# EAGLE design Thermostat (EAGLE 7.6.0)
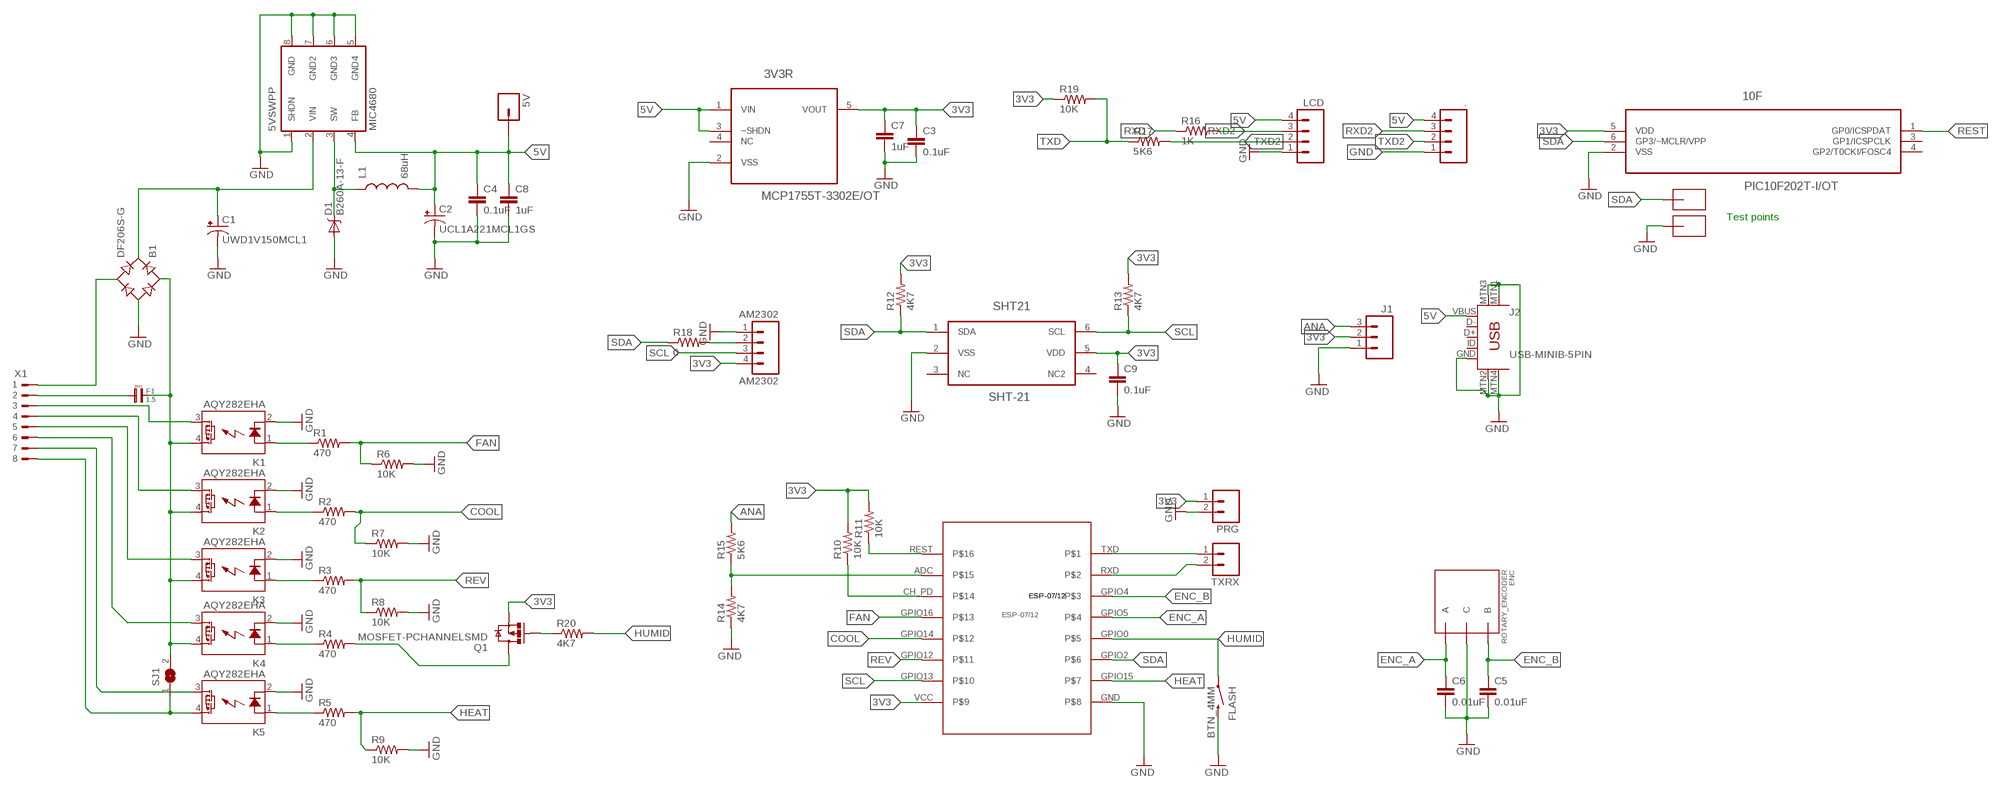
[diagram p0: schematic, sheet 1]

## Parts
3V3R  MCP1755T-3302E/OT  MCP1801T-3302I/OT  [SOT95P270X145-5N]
5V  M01PTH  [1X01]
5VSWPP  MIC4680  [SO08]
10F  PIC10F202T-I/OT  [SOT95P270X145-6N]
.  M04PTH  [1X04]
AM2302  AM2302  M04PTH  [1X04]
B1  DF206S-G  DF01S  [DFS]
C1  UWD1V150MCL1  CAP_POLC  [PANASONIC_C]
C2  UCL1A221MCL1GS  CAP_POLD  [PANASONIC_D]
C3  0.1uF  CAP0805  [0805]
C4  0.1uF  CAP0805  [0805]
C5  0.01uF  CAP0805  [0805]
C6  0.01uF  CAP0805  [0805]
C7  1uF  CAP0805  [0805]
C8  1uF  CAP0805  [0805]
C9  0.1uF  CAP0805  [0805]
D1  B260A-13-F  DIODE-SCHOTTKY_  [SMA-DIODE]
ENC  ROTARY_ENCODER  [ROTORY_ENC]
F1  1.5  0,1ÂµF  [L4,8]
FLASH  BTN_4MM  [BTN_4MM]
J1  M03PTH  [1X03]
J2  USB-MINIB-5PIN  [USB-MINIB]
K1  AQY282EHA  AQY22SOP  [SOP04]
K2  AQY282EHA  AQY22SOP  [SOP04]
K3  AQY282EHA  AQY22SOP  [SOP04]
K4  AQY282EHA  AQY22SOP  [SOP04]
K5  AQY282EHA  AQY22SOP  [SOP04]
L1  68uH  INDUCTORDR1030  [DR1030]
LCD  M04PTH  [1X04]
PRG  M02PTH  [1X02]
Q1  MOSFET-PCHANNELSMD  [SOT23-3]
R1  470  RESISTOR0805-RES  [0805]
R2  470  RESISTOR0805-RES  [0805]
R3  470  RESISTOR0805-RES  [0805]
R4  470  RESISTOR0805-RES  [0805]
R5  470  RESISTOR0805-RES  [0805]
R6  10K  RESISTOR0805-RES  [0805]
R7  10K  RESISTOR0805-RES  [0805]
R8  10K  RESISTOR0805-RES  [0805]
R9  10K  RESISTOR0805-RES  [0805]
R10  10K  RESISTOR0805-RES  [0805]
R11  10K  RESISTOR0805-RES  [0805]
R12  4K7  RESISTOR0805-RES  [0805]
R13  4K7  RESISTOR0805-RES  [0805]
R14  4K7  RESISTOR0805-RES  [0805]
R15  5K6  RESISTOR0805-RES  [0805]
R16  1K  RESISTOR0805-RES  [0805]
R17  5K6  RESISTOR0805-RES  [0805]
R18  0  RESISTOR0805-RES  [0805]
R19  10K  RESISTOR0805-RES  [0805]
R20  4K7  RESISTOR0805-RES  [0805]
SHT21  SHT-21  [SHT21]
SJ1  SJ  [SJ]
TXRX  M02PTH  [1X02]
U$1  ESP-07/12  [ESP-07/12]
U$2  SMD-PAD1  [SMD-PAD1]
U$5  SMD-PAD1  [SMD-PAD1]
X1  180-8  [180-8]

## Nets
3V3: 3V3R.5(VOUT) 10F.5(VDD) AM2302.4 C3.1 C7.1 C9.1 J1.2 PRG.1 Q1.2(S) R10.2 R11.2 R12.2 R13.2 R19.1 SHT21.5(VDD) U$1.VCC
5V: 3V3R.1(VIN) 3V3R.3(~SHDN) 5V.1 5VSWPP.4(FB) ..4 C2.+ C4.1 C8.1 J2.VBUS L1.2 LCD.4
ADC: R14.2 R15.1 U$1.ADC
ANA: J1.3 R15.2
COOL: R2.2 R7.1 U$1.GPIO14
ENC_A: C6.1 ENC.A U$1.GPIO5
ENC_B: C5.1 ENC.B U$1.GPIO4
FAN: R1.2 R6.1 U$1.GPIO16
GND: 3V3R.2(VSS) 5VSWPP.1(SHDN) 5VSWPP.5(GND4) 5VSWPP.6(GND3) 5VSWPP.7(GND2) 5VSWPP.8(GND) 10F.2(VSS) ..1 AM2302.1 B1.- C1.- C2.- C3.2 C4.2 C5.2 C6.2 C7.2 C8.2 C9.2 D1.A ENC.C FLASH.2 J1.1 J2.GND J2.MTN1(MTN2) J2.MTN2(MTN3) J2.MTN3(MTN1) J2.MTN4 K1.2(K) K2.2(K) K3.2(K) K4.2(K) K5.2(K) LCD.1 PRG.2 R6.2 R7.2 R8.2 R9.2 R14.1 SHT21.2(VSS) U$1.GND U$2.>NAME
HEAT: R5.2 R9.1 U$1.GPIO15
HUMID: FLASH.1 R20.2 U$1.GPIO0
N$1: Q1.1(G) R20.1
N$2: 5VSWPP.3(SW) D1.C L1.1
N$3: B1.AC1 F1.P$2 K1.4(DS1) K2.4(DS1) K3.4(DS1) K4.4(DS1) SJ1.2
N$4: K1.1(A) R1.1
N$7: K2.1(A) R2.1
N$9: Q1.3(D) R4.2
N$10: K3.1(A) R3.1
N$11: K4.3(DS2) X1.6
N$13: K2.3(DS2) X1.4
N$14: K4.1(A) R4.1
N$15: K1.3(DS2) X1.3
N$16: AM2302.2 R18.2
N$18: K5.3(DS2) X1.7
N$20: B1.AC2 X1.1
N$24: 5VSWPP.2(VIN) B1.+ C1.+
N$25: K5.1(A) R5.1
N$27: K5.4(DS1) SJ1.1 X1.8
N$29: K3.3(DS2) X1.5
N$30: R10.1 U$1.CH_PD
N$32: F1.P$1 X1.2
REST: 10F.1(GP0/ICSPDAT) R11.1 U$1.REST
REV: R3.2 R8.1 U$1.GPIO12
RXD: R16.1 TXRX.2 U$1.RXD
RXD2: ..3 LCD.3 R16.2
SCL: AM2302.3 R13.1 SHT21.6(SCL) U$1.GPIO13
SDA: 10F.6(GP3/~MCLR/VPP) R12.1 R18.1 SHT21.1(SDA) U$1.GPIO2 U$5.>NAME
TXD: R17.1 R19.2 TXRX.1 U$1.TXD
TXD2: ..2 LCD.2 R17.2
Unconnected: 3V3R.4(NC) 10F.3(GP1/ICSPCLK) 10F.4(GP2/T0CKI/FOSC4) J2.D+ J2.D- J2.ID SHT21.4(NC2)

## Notes on the sheet
- Test points

## Power pins joined to a net without a drawn wire
NC: SHT21.3(NC)

## Library data of the parts
3V3R = Microchip_By_element14_Batch_1:MCP1801T-3302I/OT: Low Quiescent Current LDO; MPN: MCP1801T-3302I/OT; OC_FARNELL: 1578370; OC_NEWARK: 54M4830; PACKAGE: SOT-5; SUPPLIER: Microchip
5V = SparkFun-Connectors:M01: Header 1 Standard 1-pin 0.1" header. Use with straight break away headers (SKU : PRT-00116), right angle break away headers (PRT-00553), swiss pins (PRT-00743), machine pins (PRT-00117), and female headers (PRT-00115). SMTSO-256-ET is a "flush mount" nut for a 4-40 screw. The older package used to be too tight, and did not allow it to sit properly thru the drill hit. The latest (0.165DIA) fits nice and snug.
5VSWPP = CuriousTech:MIC4680
10F = Microchip_By_element14_Batch_1:PIC10F202T-I/OT: 8-bit Flash Microcontroller; MPN: PIC10F202T-I/OT; OC_FARNELL: 9942874; OC_NEWARK: 07J7310; PACKAGE: SOT-6; SUPPLIER: Microchip Technology
. AM2302 LCD = SparkFun-Connectors:M04: Header 4 Standard 4-pin 0.1" header. Use with straight break away headers (SKU : PRT-00116), right angle break away headers (PRT-00553), swiss pins (PRT-00743), machine pins (PRT-00117), and female headers (PRT-00115). Molex polarized connector foot print use with SKU : PRT-08231 with associated crimp pins and housings. 1MM SMD Version SKU: PRT-10208
B1 = rectifier:DF*S: Surface Mount Glass Passivated Bridge Rectifiers Source: Source: Comchip Bridge Rectifiers DF005S-G thru DF10S-G.pdf
C1 C2 = SparkFun-Capacitors:CAP_POL: Capacitor Polarized These are standard SMD and PTH capacitors. Normally 10uF, 47uF, and 100uF in electrolytic and tantalum varieties. Always verify the external diameter of the through hole cap, it varies with capacity, voltage, and manufacturer. The EIA devices should be standard.
C3-C9 = SparkFun-Capacitors:CAP: Capacitor Standard 0603 ceramic capacitor, and 0.1" leaded capacitor.
D1 = SparkFun-DiscreteSemi:DIODE-SCHOTTKY: Commonly MBRA140.
ENC = CuriousTech:ROTARY_ENCODER: Panasonic EVEG Rotary Encoder
F1 = Capacitor-Wima-SMD1812-100v:0,1ÂµF
FLASH = CuriousTech:BTN_4MM
J1 = SparkFun-Connectors:M03: Header 3 Standard 3-pin 0.1" header. Use with straight break away headers (SKU : PRT-00116), right angle break away headers (PRT-00553), swiss pins (PRT-00743), machine pins (PRT-00117), and female headers (PRT-00115). Molex polarized connector foot print use with SKU : PRT-08232 with associated crimp pins and housings.
J2 = SparkFun-Connectors:USB-MINIB: Mini-USB "B" connector with 5th pin broken out. Created new symbol breaking out 5th "ID" pin in mini/micro USB connector spec. See: http://en.wikipedia.org/wiki/Mini_usb#Cables. Uses same footprint as 4-pin symbol. Also added pins to connect to mounting / shield pads if required (probably not generally needed as signals aren't shielded once they leave the connector).; PROD_ID: CONN-08193
K1-K5 = relay:AQY*: PhotoMOS Relay NAiS Source: http://www.panasonic-electric-works.com/catalogues/downloads/photomos/ds_x615_en_aqz10_20.pdf; OC_FARNELL: unknown; OC_NEWARK: unknown
L1 = SparkFun-Passives:INDUCTOR: Inductors Basic Inductor/Choke - 0603 and 1206. Footprints are not proven and vary greatly between part numbers.
PRG TXRX = SparkFun-Connectors:M02: Standard 2-pin 0.1" header. Use with - straight break away headers ( PRT-00116) - right angle break away headers (PRT-00553) - swiss pins (PRT-00743) - machine pins (PRT-00117) - female headers (PRT-00115) Molex polarized connector foot print use with: PRT-08233 with associated crimp pins and housings. 2.54_SCREWTERM for use with PRT-10571. 3.5mm Screw Terminal footprints for PRT-08084 5mm Screw Terminal footprints for use with PRT-08432
Q1 = SparkFun-DiscreteSemi:MOSFET-PCHANNEL: Generic PMOSFET IRLML2244 - TRANS-11153 (SOT-23 -20V -4.3A) (1.Gate 2.Source 3.Drain) FQP27P06 - COM-10349 <http://www.sparkfun.com/products/10349> (TO-220 -60V -27A) (1.Gate 2.Source 3.Drain)
R1-R9 R20 = SparkFun-Passives:RESISTOR: Resistor Basic schematic elements and footprints for 0603, 1206, and PTH resistors.
R10-R19 = SparkFun-Resistors:RESISTOR: Resistor Basic schematic elements and footprints for 0603, 1206, and PTH resistors.
SHT21 = CuriousTech:SHT-21
SJ1 = jumper:SJ: SMD solder JUMPER
U$1 = ESP-07_12:ESP-07/12: Version 1.0 of the library for the ESP-07/12 full GPIO dev board module byME Jon jonnyradu@gmail.com
U$2 U$5 = CuriousTech:SMD-PAD1: SMD-PAD small
X1 = con-weidmueller-sl35:180-8: WEIDMUELLER CLAMP CONNECTOR; OC_FARNELL: unknown; OC_NEWARK: unknown

## Board
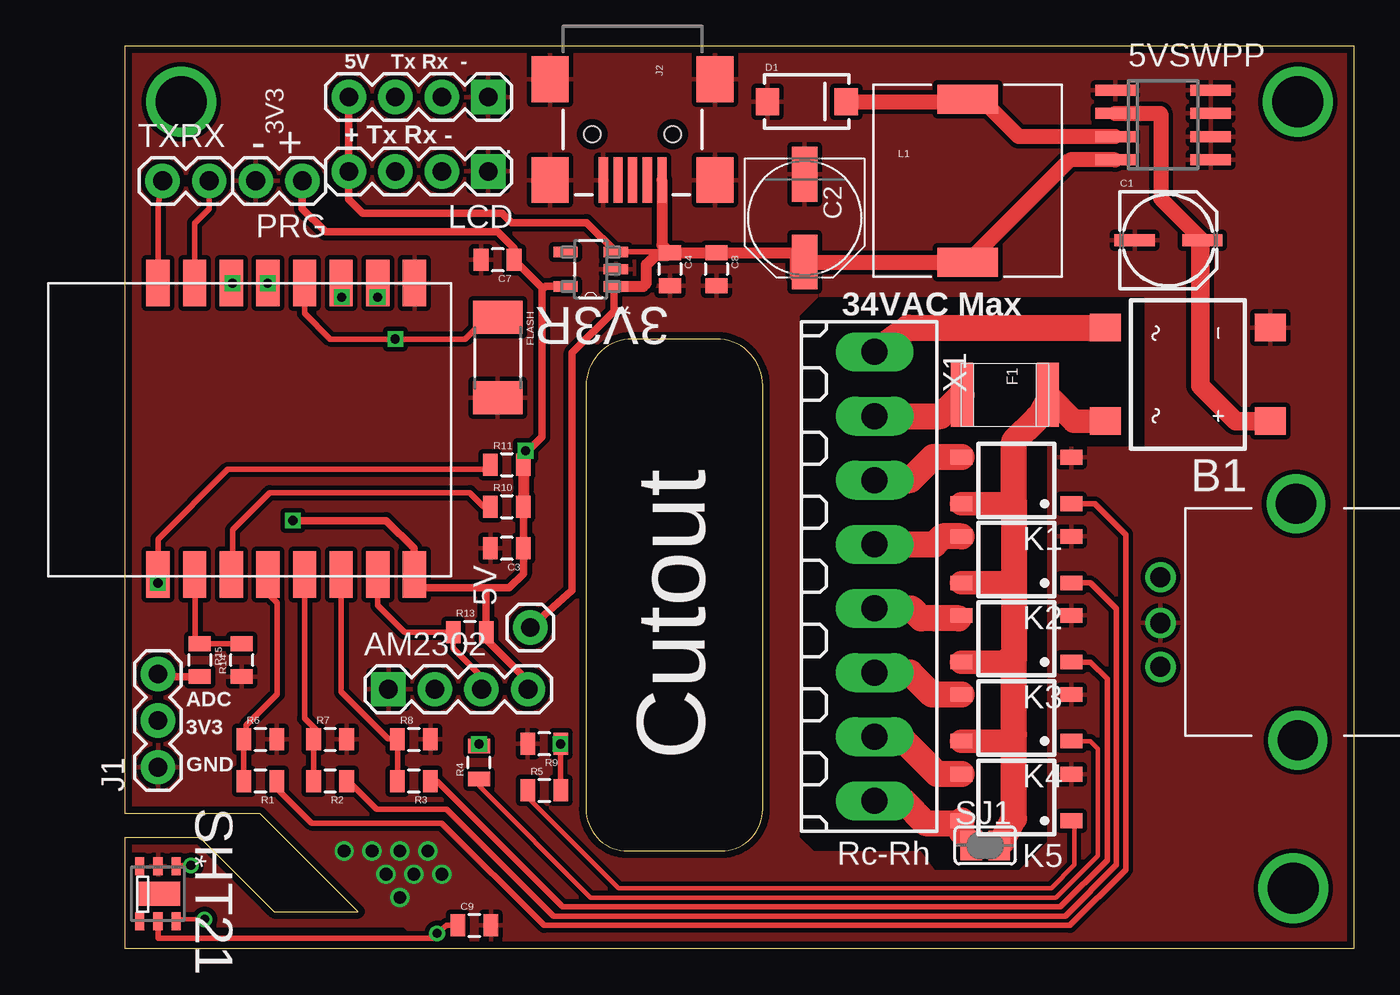
[diagram p1: board, top side]
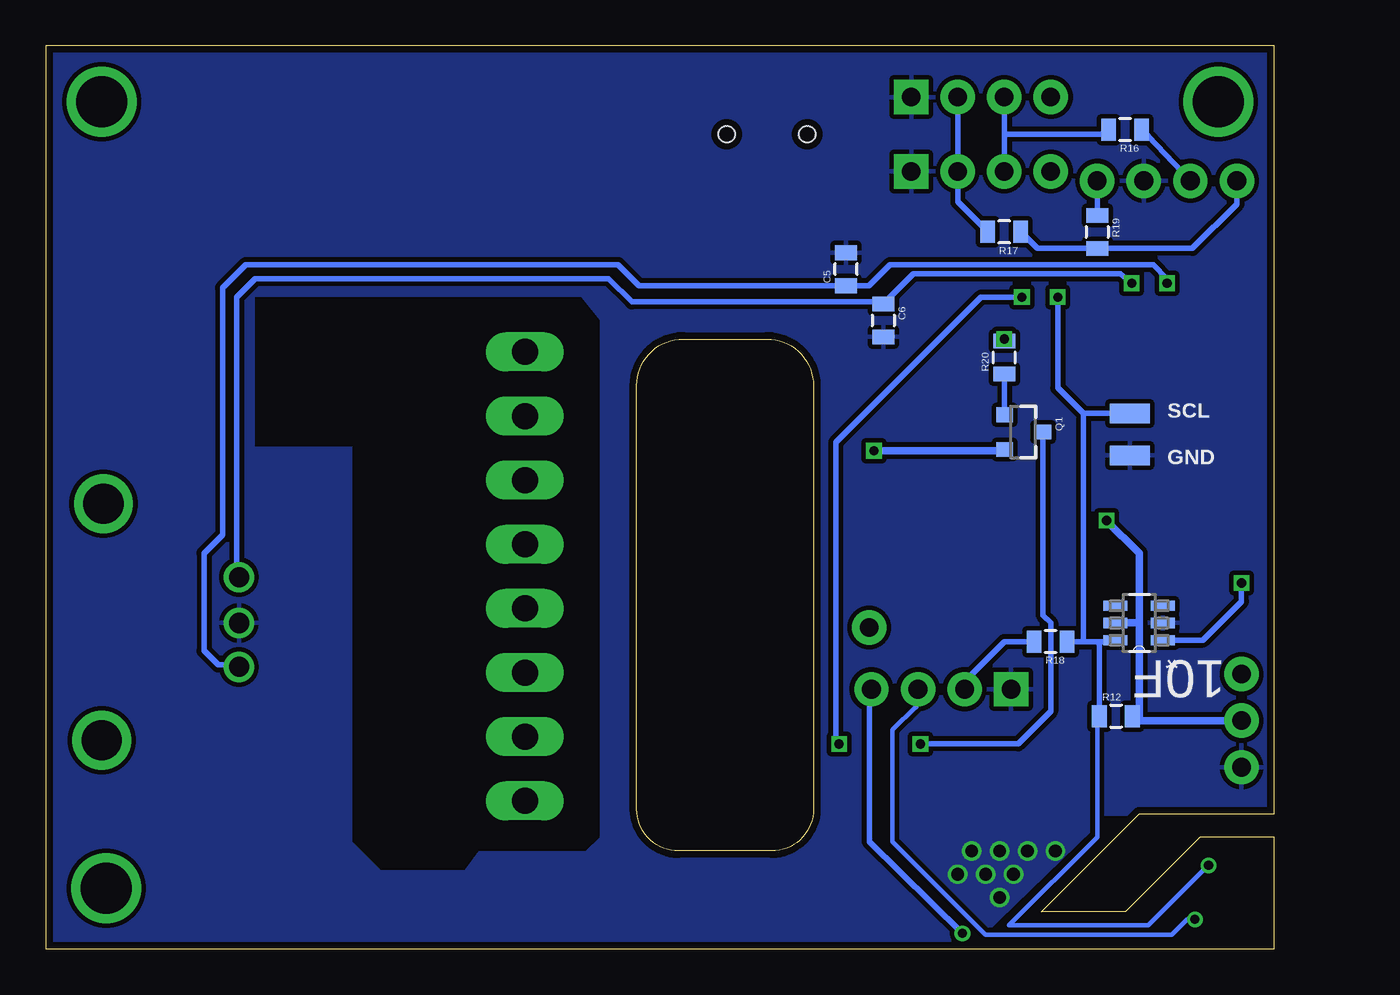
[diagram p2: board, bottom side, seen from below]

Size 67.06 x 49.28 mm. Coordinates in mm from the lower left corner, seen from the top.
Outline: 67.06,0 0,0 0,6.1 4.06,6.1 8.13,2.03 12.7,2.03 7.37,7.37 0,7.37 0,49.28 67.06,49.28 67.06,0
Outline: 34.8,7.62 34.8,30.73 arc90 32.26,33.27 27.69,33.27 arc90 25.15,30.73 25.15,7.62 arc90 27.43,5.33 32.51,5.33 arc90 34.8,7.62
Copper layers (1*16): Top 0.0356mm / dielectric 1.5011mm / Bottom 0.0356mm
Design rules "LaenPCBOrder": minimum track width 6mil, minimum drill 13mil, track to track 6mil, track to pad 6mil, pad to pad 6mil, via to via 6mil, smd to smd 6mil, copper to edge 15mil, drill to drill 6mil, minimum pad ring 7mil, minimum via ring 7mil, stop-mask expansion 4mil, vias tented up to drill 0mil, thermal gap 10mil

### Footprints (pad centres in the part's own frame; a part is rotated, then mirrored left to right if it is on the bottom)
SOT95P270X145-5N = smd 1.321 x 0.559: 1 -1.372,0.94; 2 -1.372,0; 3 -1.372,-0.94; 4 1.372,-0.94; 5 1.372,0.94
1X01 = drill 1.016 pad 1.88: 1 0,0
SO08 = smd 0.6 x 2.2: 1 -1.905,-2.6; 2 -0.635,-2.6; 3 0.635,-2.6; 4 1.905,-2.6; 5 1.905,2.6; 6 0.635,2.6; 7 -0.635,2.6; 8 -1.905,2.6
SOT95P270X145-6N = smd 1.321 x 0.559: 1 -1.295,0.94; 2 -1.295,0; 3 -1.295,-0.94; 4 1.295,-0.94; 5 1.295,0; 6 1.295,0.94
1X04 = drill 1.016 pad 1.88 square: 1 0,0 | drill 1.016 pad 1.88: 2 2.54,0; 3 5.08,0; 4 7.62,0
DFS = smd 1.5 x 1.7: + -2.55,-4.5; - 2.55,-4.5; AC1 -2.55,4.5; AC2 2.55,4.5
PANASONIC_C = smd 2.2 x 0.65: + 1.9,-0.2; - -1.8,-0.2
PANASONIC_D = smd 3 x 1.4: + 2.4,0; - -2.4,0
0805 = smd 0.8 x 1.2: 1 -0.9,0; 2 0.9,0
SMA-DIODE = smd 1.27 x 1.47: A -2.15,0; C 2.15,0
ROTORY_ENC = drill 1.1: A -7.5,2.5; B -7.5,-2.4; C -7.5,0 | drill 2.2: P$1 -0.1,6.5; P$2 0,-6.4
L4,8 = smd 3.5 x 1.2: P$1 0,-2.35; P$2 0,2.35
BTN_4MM = smd 1.8 x 2.7: 1 -2.2,0; 2 2.2,0
1X03 = drill 1.016 pad 1.88: 1 0,0; 2 2.54,0; 3 5.08,0
USB-MINIB = smd 2.5 x 0.5: D+ 2.5,0; D- 2.5,0.8; GND 2.5,-1.6; ID 2.5,-0.8; VBUS 2.5,1.6 | smd 2.5 x 2: MTN1 -3,4.5; MTN2 2.5,4.5; MTN3 -3,-4.5; MTN4 2.5,-4.5 | hole 0.9: 0,2.2; 0,-2.2
SOP04 = smd 0.8 x 1.2: 1 -1.27,-3; 2 1.27,-3; 3 1.27,3; 4 -1.27,3
DR1030 = smd 3.3 x 1.6: 1 0,4.45; 2 0,-4.45
1X02 = drill 1.016 pad 1.88: 1 0,0; 2 2.54,0
SOT23-3 = smd 0.8 x 0.9: 1 -0.95,-1; 2 0.95,-1; 3 0,1.1
SHT21 = smd 1 x 0.5: 1 -1.5,1; 2 -1.5,0; 3 -1.5,-1; 4 1.5,-1; 5 1.5,0; 6 1.5,1 | smd 1.3 x 2.4: P$1 0,0
SJ = smd 1.168 x 1.6: 1 -0.762,0; 2 0.762,0
ESP-07/12 = smd 2.54 x 1.27: ADC 0.1,14; CH_PD 0.1,12; GND 16,2; GPIO0 16,8; GPIO2 16,6; GPIO4 16,12; GPIO5 16,10; GPIO12 0.1,6; GPIO13 0.1,4; GPIO14 0.1,8; GPIO15 16,4; GPIO16 0.1,10; REST 0.1,16; RXD 16,14; TXD 16,16; VCC 0.1,2
SMD-PAD1 = smd 2.184 x 1.067: >NAME 0,0
180-8 = drill 1.422 long: 1 -12.25,0; 2 -8.75,0; 3 -5.25,0; 4 -1.75,0; 5 1.75,0; 6 5.25,0; 7 8.75,0; 8 12.25,0

### Placement (x,y rotation side)
3V3R  25.4,37.08 180 top
5V  22.1,17.53 90 top
5VSWPP  56.64,44.96 270 top
10F  7.37,17.78 180 bottom
.  19.81,46.48 180 top
AM2302  14.36,14.16 0 top
B1  58,31.34 90 top
C1  56.9,38.86 0 top
C2  37.08,39.88 270 top
C3  20.83,21.84 180 top
C4  29.72,37.08 270 top
C5  23.37,37.08 90 bottom
C6  21.34,34.29 270 bottom
C7  20.32,37.59 180 top
C8  32.26,37.08 270 top
C9  19.05,1.27 0 top
D1  37.2,46.23 0 top
ENC  64.01,17.78 0 top
F1  48.01,30.23 270 top
FLASH  20.32,32.26 270 top
J1  1.78,9.91 90 top
J2  27.69,44.45 270 top
K1  48.65,25.55 90 top
K2  48.65,21.24 90 top
K3  48.65,16.92 90 top
K4  48.65,12.6 90 top
K5  48.65,8.26 90 top
L1  45.97,41.91 0 top
LCD  19.81,42.42 180 top
PRG  9.65,41.91 180 top
Q1  13.72,28.19 270 bottom
R1  7.37,9.14 180 top
R2  11.18,9.14 180 top
R3  15.75,9.14 180 top
R4  19.3,10.16 90 top
R5  22.86,8.64 0 top
R6  7.37,11.43 0 top
R7  11.18,11.43 0 top
R8  15.75,11.43 0 top
R9  22.86,11.18 180 top
R10  20.83,24.13 0 top
R11  20.83,26.42 0 top
R12  8.64,12.7 0 bottom
R13  18.8,17.27 0 top
R14  6.35,15.75 90 top
R15  4.06,15.75 270 top
R16  8.13,44.7 180 bottom
R17  14.73,39.12 180 bottom
R18  12.19,16.76 180 bottom
R19  9.65,39.12 270 bottom
R20  14.73,32.26 90 bottom
SHT21  1.78,3 270 top
SJ1  46.94,5.64 0 top
TXRX  2.03,41.91 0 top
U$1  17.78,20.32 90 top
U$2  7.87,26.92 0 bottom
U$5  7.87,29.21 0 bottom
X1  40.89,20.32 270 top

### Tracks (layer width: path | path; a pad name or v marks a point on that pad's centre or on a via)
3V3  (via drill 0.5)
  Top 0.305: v21.84,27.18 21.84,27.21 | SHT21.5 1.78,0.58 16.76,0.58 v17.02,0.84 17.53,1.27 C9.1
  Top 0.406: 15.75,19.69 19.56,19.69 | 19.56,19.69 20.94,19.69 21.73,20.47 C3.1 R10.2 | 22.74,36.07 22.74,27.94 21.98,27.18 21.84,27.21 | PRG.1 9.65,40.39 10.92,39.12 20.32,39.12 21.22,38.22 C7.1 22.74,36.07 | v9.14,23.37 14.22,23.37 15.75,21.84 15.75,19.69 | 15.75,19.69 U$1.VCC | 19.56,19.69 19.7,19.55 R13.2 19.7,16.88 21.84,14.73 21.84,14.3 AM2302.4 | v21.84,27.18 21.84,26.53 R11.2 | 3V3R.5 22.94,36.14 22.86,36.07 22.74,36.07
  Top 0.61: R11.2 R10.2
  Bottom 0.254: R12.2 7.37,12.7
  Bottom 0.305: R19.1 PRG.1 | v17.02,0.84 22.1,5.84 22.1,14.05 AM2302.4
  Bottom 0.406: 10F.5 7.37,17.78 | 7.37,17.78 7.37,12.7 7.37,12.45 J1.2 | 7.37,17.78 7.37,21.59 v9.14,23.37 | Q1.2 15.04,27.18 v21.84,27.18
5V
  Top 0.305: 3V3R.3 29.68,38.02 C4.1
  Top 0.406: ..4 LCD.4 12.19,40.89 12.95,40.13 20.57,40.13 21.08,39.62 25.17,39.62 3V3R.3 | 5V.1 24.38,19.56 24.38,32.51 26.67,34.8 26.67,36.04 3V3R.1
  Top 0.61: C2.+ 36.58,36.72 36.58,37.85 | 37.29,37.37 37.29,37.98 C8.1 C4.1 | J2.VBUS 29.29,38.42 C4.1 | 3V3R.1 28.27,36.14 28.45,36.32 28.45,37.34 28.96,37.85 29.58,37.85 C4.1
  Top 0.813: 5VSWPP.4 51.57,43.05 L1.2 37.35,37.45 37.29,37.37 C2.+
  Top 1.016: 46.23,37.21 L1.2
ADC
  Top 0.305: U$1.ADC 3.81,20.42 3.81,17.02 4.06,16.76 R15.1 R14.2
ANA
  Top 0.406: R15.2 2.15,14.85 J1.3
COOL
  Top 0.305: U$1.GPIO14 9.78,12.57 10.41,11.94 10.41,11.55 R7.1 R2.2
ENC_A  (via drill 0.5)
  Top 0.406: U$1.GPIO5 7.78,36.23 v7.77,36.32
  Bottom 0.305: v7.77,36.32 8.38,36.83 19.7,36.83 C6.1 21.47,35.19 21.84,35.31 35.05,35.31 36.32,36.58 55.63,36.58 56.64,35.56 56.64,20.41 ENC.A
ENC_B  (via drill 0.5)
  Top 0.305: U$1.GPIO4 5.78,36.26 v5.84,36.32
  Bottom 0.305: v5.84,36.32 5.84,36.58 6.6,37.34 20.97,37.34 22.12,36.18 C5.1 34.66,36.18 35.81,37.34 56.13,37.34 57.4,36.07 57.4,22.61 58.42,21.59 58.42,16.26 57.66,15.49 56.62,15.49 ENC.B
FAN
  Top 0.305: R1.2 R6.1 6.6,11.43 6.6,12.19 8.29,13.88 8.29,18.89 7.87,19.3 U$1.GPIO16
GND  (via drill 0.7)
  other vias: 11.94,5.33 13.46,5.33 14.99,5.33 16.51,5.33 14.22,4.06 15.75,4.06 14.99,2.79 17.27,4.06
  pour Top (isolate 0.254): 0,1.27 15.24,1.27 16.51,0 67.06,0 67.06,49.28 0,49.28
  pour Bottom (isolate 0.254): 67.06,0 16.76,0 9.14,7.37 0,7.37 0,49.28 67.06,49.28
  cutout Top (isolate 0.254): 36.83,34.54 36.83,6.1 37.59,5.33 43.43,5.33 44.2,4.32 48.77,4.32 50.29,5.84 50.29,27.43 55.63,27.43 55.63,35.56 37.85,35.56
  cutout Bottom (isolate 0.254): 36.83,34.29 36.83,6.1 37.59,5.33 43.43,5.33 44.2,4.32 48.77,4.32 50.29,5.84 50.29,27.43 55.63,27.43 55.63,35.56 37.85,35.56
HEAT  (via drill 0.5)
  Top 0.305: 13.78,35.75 v13.77,35.56 | R5.2 R9.1 | U$1.GPIO15 13.78,35.62 | 13.78,35.62 v13.77,35.56 | 13.78,35.62 13.78,35.57 v13.77,35.56
  Top 0.61: v23.75,11.18 R9.1
  Bottom 0.254: v23.75,11.18 23.93,11.35
  Bottom 0.305: v13.77,35.56 16,35.56 23.93,27.64 23.93,11.35
HUMID  (via drill 0.5)
  Top 0.305: U$1.GPIO0 9.78,34.67 11.18,33.27 v14.73,33.27 18.54,33.27 19.05,33.78 FLASH.1
  Bottom 0.305: R20.2 v14.73,33.27
N$1
  Bottom 0.305: R20.1 14.72,31.1 Q1.1
N$2
  Top 0.813: D1.C 45.47,46.23 | 45.47,46.23 L1.1 | 5VSWPP.3 48.77,44.32 47.12,45.98 45.47,46.23
N$3
  Top 1.016: 47.85,5.84 SJ1.2
  Top 1.27: K3.4 47.91,15.65 | 47.91,15.65 48.51,16 | K1.4 47.91,24.28 48.51,24.38 | K2.4 48.41,19.97 48.51,20.32 | 48.51,15.8 47.91,15.65 | 49.78,28.96 50.29,29.91 F1.P$2 51.79,28.79 B1.AC1 | K4.4 48.16,11.33 48.51,11.68
  Top 1.422: 47.85,5.84 48.51,7.11 48.51,11.68 48.51,15.8 48.51,16 48.51,20.32 48.51,24.38 48.51,27.69 49.78,28.96
N$4
  Top 0.305: K1.1 52.93,24.28 54.61,22.61 54.61,4.32 51.56,1.27 22.86,1.27 17.27,6.86 10.16,6.86 8.13,8.89 R1.1
N$5  (via drill 2.8)
  other vias: 63.75,3.3
N$6  (via drill 2.8)
  other vias: 64.01,46.23
N$7
  Top 0.305: K2.1 52.68,19.97 54.1,18.54 54.1,4.57 51.31,1.78 23.37,1.78 17.53,7.62 13.72,7.62 12.19,9.14 12.19,9.03 R2.1
N$8  (via drill 2.8)
  other vias: 3.05,46.23
N$9  (via drill 0.5)
  Top 0.305: 19.3,11.08 19.44,11.18 R4.2 19.19,10.92 v19.3,11.18
  Bottom 0.305: Q1.3 12.62,18.2 12.19,17.78 12.19,12.95 13.97,11.18 v19.3,11.18
N$10
  Top 0.305: K3.1 52.68,15.65 53.59,14.73 53.59,4.83 51.05,2.29 23.88,2.29 17.02,9.14 R3.1
N$11
  Top 1.422: X1.6 42.84,15.07 44.04,13.87 K4.3
N$13
  Top 1.422: X1.4 44.17,22.07 44.6,22.51 K2.3
N$14
  Top 0.254: K4.1 52.68,11.33 53.09,10.92 53.09,5.08 50.8,2.79 25.4,2.79 19.3,8.89 R4.1
N$15
  Top 1.422: X1.3 42.84,25.57 44.1,26.82 K1.3
N$16
  Bottom 0.305: R18.2 14.73,16.76 16.51,14.99 16.51,14.53 AM2302.2
N$18
  Top 1.422: X1.7 42.28,11.57 44.32,9.53 K5.3
N$20
  Top 1.27: B1.AC2 53.45,33.89
  Top 1.422: X1.1 42.72,33.89 53.45,33.89
N$24
  Top 0.813: 5VSWPP.2 56.52,45.59 56.52,40.94 C1.+ 58.55,38.66 58.67,38.54
  Top 1.016: B1.+ 60.62,28.79 58.67,30.73 58.67,38.54
N$25
  Top 0.254: K5.1 51.82,6.82 51.82,4.57 50.55,3.3 26.92,3.3 21.96,8.27 R5.1
N$27
  Top 1.016: 45.65,6.36 SJ1.1
  Top 1.422: X1.8 42.48,8.07 43.69,6.86 45.52,6.86 K5.4 45.65,6.36
N$29
  Top 0.305: K3.3 44.35,18.19 44.2,18.03
  Top 1.422: X1.5 42.9,18.57 43.43,18.03 44.2,18.03 45.5,18.03
N$30
  Top 0.305: U$1.CH_PD 5.84,20.67 5.84,22.86 7.87,24.89 18.8,24.89 19.56,24.13 R10.1
N$32
  Top 1.422: X1.2 44.5,29.07 F1.P$1
REST  (via drill 0.5)
  Top 0.305: R11.1 20.07,26.16 5.59,26.16 1.78,22.35 1.78,20.67 U$1.REST v1.78,19.96
  Bottom 0.305: 10F.1 3.89,16.84 1.78,18.95 v1.78,19.96
REV
  Top 0.305: U$1.GPIO12 11.78,14.01 14.34,11.45 R8.1 R3.2
RXD
  Top 0.305: U$1.RXD 3.78,39.59 4.57,40.39 TXRX.2
  Bottom 0.305: TXRX.2 6.86,44.33 R16.1
RXD2
  Bottom 0.305: ..3 14.73,44.45 | 14.73,44.45 LCD.3 | R16.2 9.14,44.7 9.4,44.45 14.73,44.45
SCL  (via drill 0.5)
  Top 0.254: 2.82,1.8 2.83,1.8 | v4.32,1.6 2.88,1.6 SHT21.6
  Top 0.305: U$1.GPIO13 13.78,18.73 15.24,17.27 R13.1 17.9,16.39 19.3,14.99 19.3,14.3 AM2302.3 | 2.83,1.8 SHT21.6
  Bottom 0.254: v4.32,1.6 4.75,1.6 5.59,0.76 15.75,0.76 20.83,5.84 20.83,11.94 19.56,13.21
  Bottom 0.305: 19.56,13.21 19.56,13.54 AM2302.3
SDA  (via drill 0.5)
  Top 0.254: v3.58,4.55 2.83,4.55
  Top 0.305: U$1.GPIO2 11.78,35.46 v11.81,35.56 | 2.83,4.55 SHT21.1
  Bottom 0.254: v3.58,4.55 6.86,1.27 14.48,1.27 9.65,6.1 9.65,12.33
  Bottom 0.305: v11.81,35.56 11.81,30.61 10.41,29.21 | 10.41,29.21 U$5.>NAME | 10.41,29.21 10.41,16.76 | R18.1 10.41,16.76 | 10.41,16.76 9.65,16.76 | 9.65,16.76 8.74,16.76 10F.6 | 9.65,12.33 R12.1 9.54,16.65 9.65,16.76
TXD
  Top 0.305: TXRX.1 1.78,40.64 U$1.TXD
  Bottom 0.305: R17.1 12.93,38.22 R19.2 4.46,38.22 2.03,40.64 TXRX.1
TXD2
  Bottom 0.305: ..2 LCD.2 17.27,40.76 R17.2

### Text on the board
tPlace: 5V | Tx Rx - | 3V3 | + Tx Rx - | - + | 34VAC Max | ADC | 3V3 | GND | Cutout | Rc-Rh
bPlace: SCL | GND
tStop: C | ESP-07 | Rc | G | Y | O | H | W | Rh
bStop: CuriousTech.net | ESP8266-HVAC